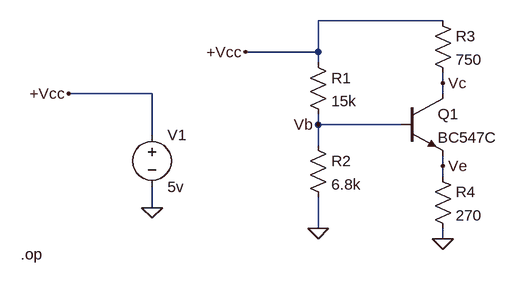
[diagram p0: schematic 2.5.1.asc]
2.5.1.asc, the LTspice schematic file:
Version 4
SHEET 1 880 680
WIRE 384 48 192 48
WIRE 192 96 192 48
WIRE 192 96 80 96
WIRE 192 112 192 96
WIRE 384 144 384 128
WIRE -64 160 -192 160
WIRE 384 160 384 144
WIRE 192 208 192 192
WIRE 320 208 192 208
WIRE -64 224 -64 160
WIRE 192 240 192 208
WIRE 384 272 384 256
WIRE 384 288 384 272
WIRE -64 336 -64 304
WIRE 192 368 192 320
WIRE 384 384 384 368
FLAG 80 96 +Vcc
FLAG 192 368 0
FLAG 384 384 0
FLAG 384 144 Vc
FLAG 192 208 Vb
FLAG 384 272 Ve
FLAG -64 336 0
FLAG -192 160 +Vcc
SYMBOL res 176 96 R0
SYMATTR InstName R1
SYMATTR Value 15k
SYMBOL res 176 224 R0
SYMATTR InstName R2
SYMATTR Value 6.8k
SYMBOL npn 320 160 R0
SYMATTR InstName Q1
SYMATTR Value BC547C
SYMBOL res 368 32 R0
SYMATTR InstName R3
SYMATTR Value 750
SYMBOL res 368 272 R0
SYMATTR InstName R4
SYMATTR Value 270
SYMBOL voltage -64 208 R0
SYMATTR InstName V1
SYMATTR Value 5v
TEXT -266 408 Left 2 !.op

The netlist it stands for:
* 2.5.1.asc
R1 +Vcc Vb 15k
R2 Vb 0 6.8k
Q1 Vc Vb Ve 0 BC547C
R3 +Vcc Vc 750
R4 Ve 0 270
V1 +Vcc 0 5v
.model NPN NPN
.model PNP PNP
.lib standard.bjt
.op
.backanno
.end